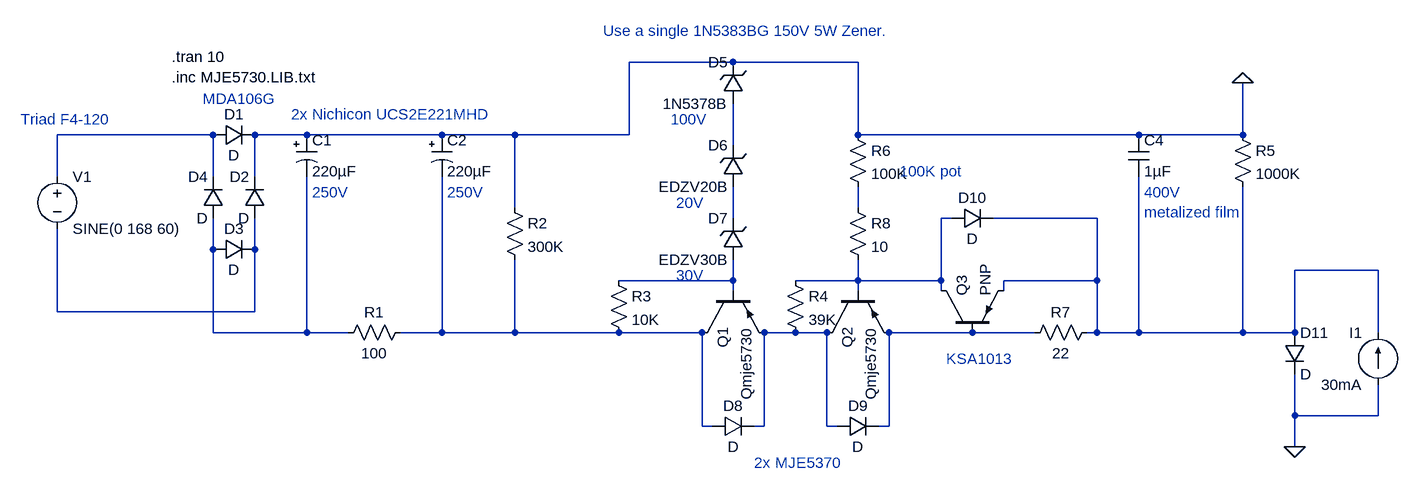
[diagram p0: schematic BiasSupply.asc]
BiasSupply.asc, the LTspice schematic file:
Version 4
SHEET 1 1996 1392
WIRE 656 -48 496 -48
WIRE 848 -48 656 -48
WIRE -144 64 -384 64
WIRE 0 64 -80 64
WIRE 208 64 0 64
WIRE 320 64 208 64
WIRE 496 64 496 -48
WIRE 496 64 320 64
WIRE 848 64 848 -48
WIRE 1280 64 848 64
WIRE 1440 64 1440 -16
WIRE 1440 64 1280 64
WIRE 656 80 656 16
WIRE -384 128 -384 64
WIRE -144 128 -144 64
WIRE -80 128 -80 64
WIRE 320 176 320 64
WIRE 848 176 848 144
WIRE 656 192 656 144
WIRE 992 192 976 192
WIRE 1216 192 1056 192
WIRE -144 240 -144 192
WIRE -80 240 -80 192
WIRE 1648 272 1520 272
WIRE 656 288 656 256
WIRE 656 288 480 288
WIRE 848 288 848 256
WIRE 848 288 752 288
WIRE 976 288 976 192
WIRE 976 288 848 288
WIRE 1216 288 1216 192
WIRE 1216 288 1072 288
WIRE 656 304 656 288
WIRE 848 304 848 288
WIRE 976 304 976 288
WIRE 1072 304 1072 288
WIRE -384 336 -384 208
WIRE -80 336 -80 240
WIRE -80 336 -384 336
WIRE -144 368 -144 240
WIRE 0 368 0 128
WIRE 0 368 -144 368
WIRE 64 368 0 368
WIRE 208 368 208 128
WIRE 208 368 144 368
WIRE 320 368 320 256
WIRE 320 368 208 368
WIRE 480 368 320 368
WIRE 608 368 480 368
WIRE 752 368 704 368
WIRE 800 368 752 368
WIRE 1024 368 896 368
WIRE 1120 368 1024 368
WIRE 1216 368 1216 288
WIRE 1216 368 1200 368
WIRE 1280 368 1280 128
WIRE 1280 368 1216 368
WIRE 1440 368 1440 144
WIRE 1440 368 1280 368
WIRE 1520 368 1520 272
WIRE 1520 368 1440 368
WIRE 1648 368 1648 272
WIRE 1520 496 1520 432
WIRE 1648 496 1648 448
WIRE 1648 496 1520 496
WIRE 608 512 608 368
WIRE 624 512 608 512
WIRE 704 512 704 368
WIRE 704 512 688 512
WIRE 800 512 800 368
WIRE 816 512 800 512
WIRE 896 512 896 368
WIRE 896 512 880 512
WIRE 1520 544 1520 496
FLAG 1440 -16 0
FLAG 1520 544 0
SYMBOL voltage -384 112 R0
SYMATTR InstName V1
SYMATTR Value SINE(0 168 60)
SYMBOL diode -144 80 R270
WINDOW 0 32 32 VTop 2
WINDOW 3 0 32 VBottom 2
SYMATTR InstName D1
SYMBOL diode -64 192 R180
WINDOW 0 24 64 Left 2
WINDOW 3 24 0 Left 2
SYMATTR InstName D2
SYMBOL diode -144 256 R270
WINDOW 0 32 32 VTop 2
WINDOW 3 0 32 VBottom 2
SYMATTR InstName D3
SYMBOL diode -128 192 R180
WINDOW 0 24 64 Left 2
WINDOW 3 24 0 Left 2
SYMATTR InstName D4
SYMBOL polcap -16 64 R0
SYMATTR InstName C1
SYMATTR Value 220µF
SYMBOL polcap 192 64 R0
SYMATTR InstName C2
SYMATTR Value 220µF
SYMBOL res 160 352 R90
WINDOW 0 0 56 VBottom 2
WINDOW 3 32 56 VTop 2
SYMATTR InstName R1
SYMATTR Value 100
SYMBOL res 304 160 R0
SYMATTR InstName R2
SYMATTR Value 300K
SYMBOL zener 672 16 R180
WINDOW 0 24 64 Left 2
WINDOW 3 24 0 Left 2
SYMATTR InstName D5
SYMATTR Value 1N5378B
SYMATTR Description Diode
SYMATTR Type diode
SYMBOL zener 672 144 R180
WINDOW 0 24 64 Left 2
WINDOW 3 24 0 Left 2
SYMATTR InstName D6
SYMATTR Value EDZV20B
SYMATTR Description Diode
SYMATTR Type diode
SYMBOL cap 1264 64 R0
SYMATTR InstName C4
SYMATTR Value 1µF
SYMBOL res 1424 48 R0
SYMATTR InstName R5
SYMATTR Value 1000K
SYMBOL zener 672 256 R180
WINDOW 0 24 64 Left 2
WINDOW 3 24 0 Left 2
SYMATTR InstName D7
SYMATTR Value EDZV30B
SYMBOL pnp 608 304 M90
SYMATTR InstName Q1
SYMATTR Value Qmje5730
SYMBOL pnp 800 304 M90
SYMATTR InstName Q2
SYMATTR Value Qmje5730
SYMBOL pnp 976 368 R270
SYMATTR InstName Q3
SYMBOL res 464 272 R0
SYMATTR InstName R3
SYMATTR Value 10K
SYMBOL res 736 272 R0
SYMATTR InstName R4
SYMATTR Value 39K
SYMBOL res 832 48 R0
SYMATTR InstName R6
SYMATTR Value 100K
SYMBOL diode 624 528 R270
WINDOW 0 32 32 VTop 2
WINDOW 3 0 32 VBottom 2
SYMATTR InstName D8
SYMBOL diode 816 528 R270
WINDOW 0 32 32 VTop 2
WINDOW 3 0 32 VBottom 2
SYMATTR InstName D9
SYMBOL diode 992 208 R270
WINDOW 0 32 32 VTop 2
WINDOW 3 0 32 VBottom 2
SYMATTR InstName D10
SYMBOL res 1216 352 R90
WINDOW 0 0 56 VBottom 2
WINDOW 3 32 56 VTop 2
SYMATTR InstName R7
SYMATTR Value 22
SYMBOL diode 1504 368 R0
SYMATTR InstName D11
SYMBOL current 1648 448 R180
WINDOW 0 24 80 Left 2
WINDOW 3 24 0 Left 2
SYMATTR InstName I1
SYMATTR Value 30mA
SYMBOL res 832 160 R0
SYMATTR InstName R8
SYMATTR Value 10
TEXT -208 -56 Left 2 !.tran 10\n.inc MJE5730.LIB.txt
TEXT 560 40 Left 2 ;100V
TEXT 568 168 Left 2 ;20V
TEXT -440 40 Left 2 ;Triad F4-120
TEXT -160 8 Left 2 ;MDA106G
TEXT 456 -96 Left 2 ;Use a single 1N5383BG 150V 5W Zener.
TEXT 1288 152 Left 2 ;400V\nmetalized film
TEXT -24 32 Left 2 ;2x Nichicon UCS2E221MHD
TEXT 8 152 Left 2 ;250V
TEXT 216 152 Left 2 ;250V
TEXT 568 280 Left 2 ;30V
TEXT 912 120 Left 2 ;100K pot
TEXT 688 568 Left 2 ;2x MJE5370
TEXT 984 408 Left 2 ;KSA1013

The netlist it stands for:
* BiasSupply.asc
V1 N001 N008 SINE(0 168 60)
D1 N001 0 D
D2 N008 0 D
D3 N007 N008 D
D4 N007 N001 D
C1 0 N007 220µF
C2 0 N010 220µF
R1 N010 N007 100
R2 0 N010 300K
D5 N002 0 1N5378B
D6 N004 N002 EDZV20B
C4 0 N006 1µF
R5 0 N006 1000K
D7 N009 N004 EDZV30B
Q1 N010 N009 N011 0 Qmje5730
Q2 N011 N005 N012 0 Qmje5730
Q3 N005 N012 N006 0 PNP
R3 N009 N010 10K
R4 N005 N011 39K
R6 0 N003 100K
D8 N010 N011 D
D9 N011 N012 D
D10 N005 N006 D
R7 N006 N012 22
D11 N006 0 D
I1 0 N006 30mA
R8 N003 N005 10
.model D D
.lib standard.dio
.model NPN NPN
.model PNP PNP
.lib standard.bjt
.tran 10
.inc MJE5730.LIB.txt
* 100V
* 20V
* Triad F4-120
* MDA106G
* Use a single 1N5383BG 150V 5W Zener.
* 400V
* metalized film
* 2x Nichicon UCS2E221MHD
* 250V
* 250V
* 30V
* 100K pot
* 2x MJE5370
* KSA1013
.backanno
.end